# EAGLE design femtoBeacon_BT5_coin (EAGLE 7.6.0)
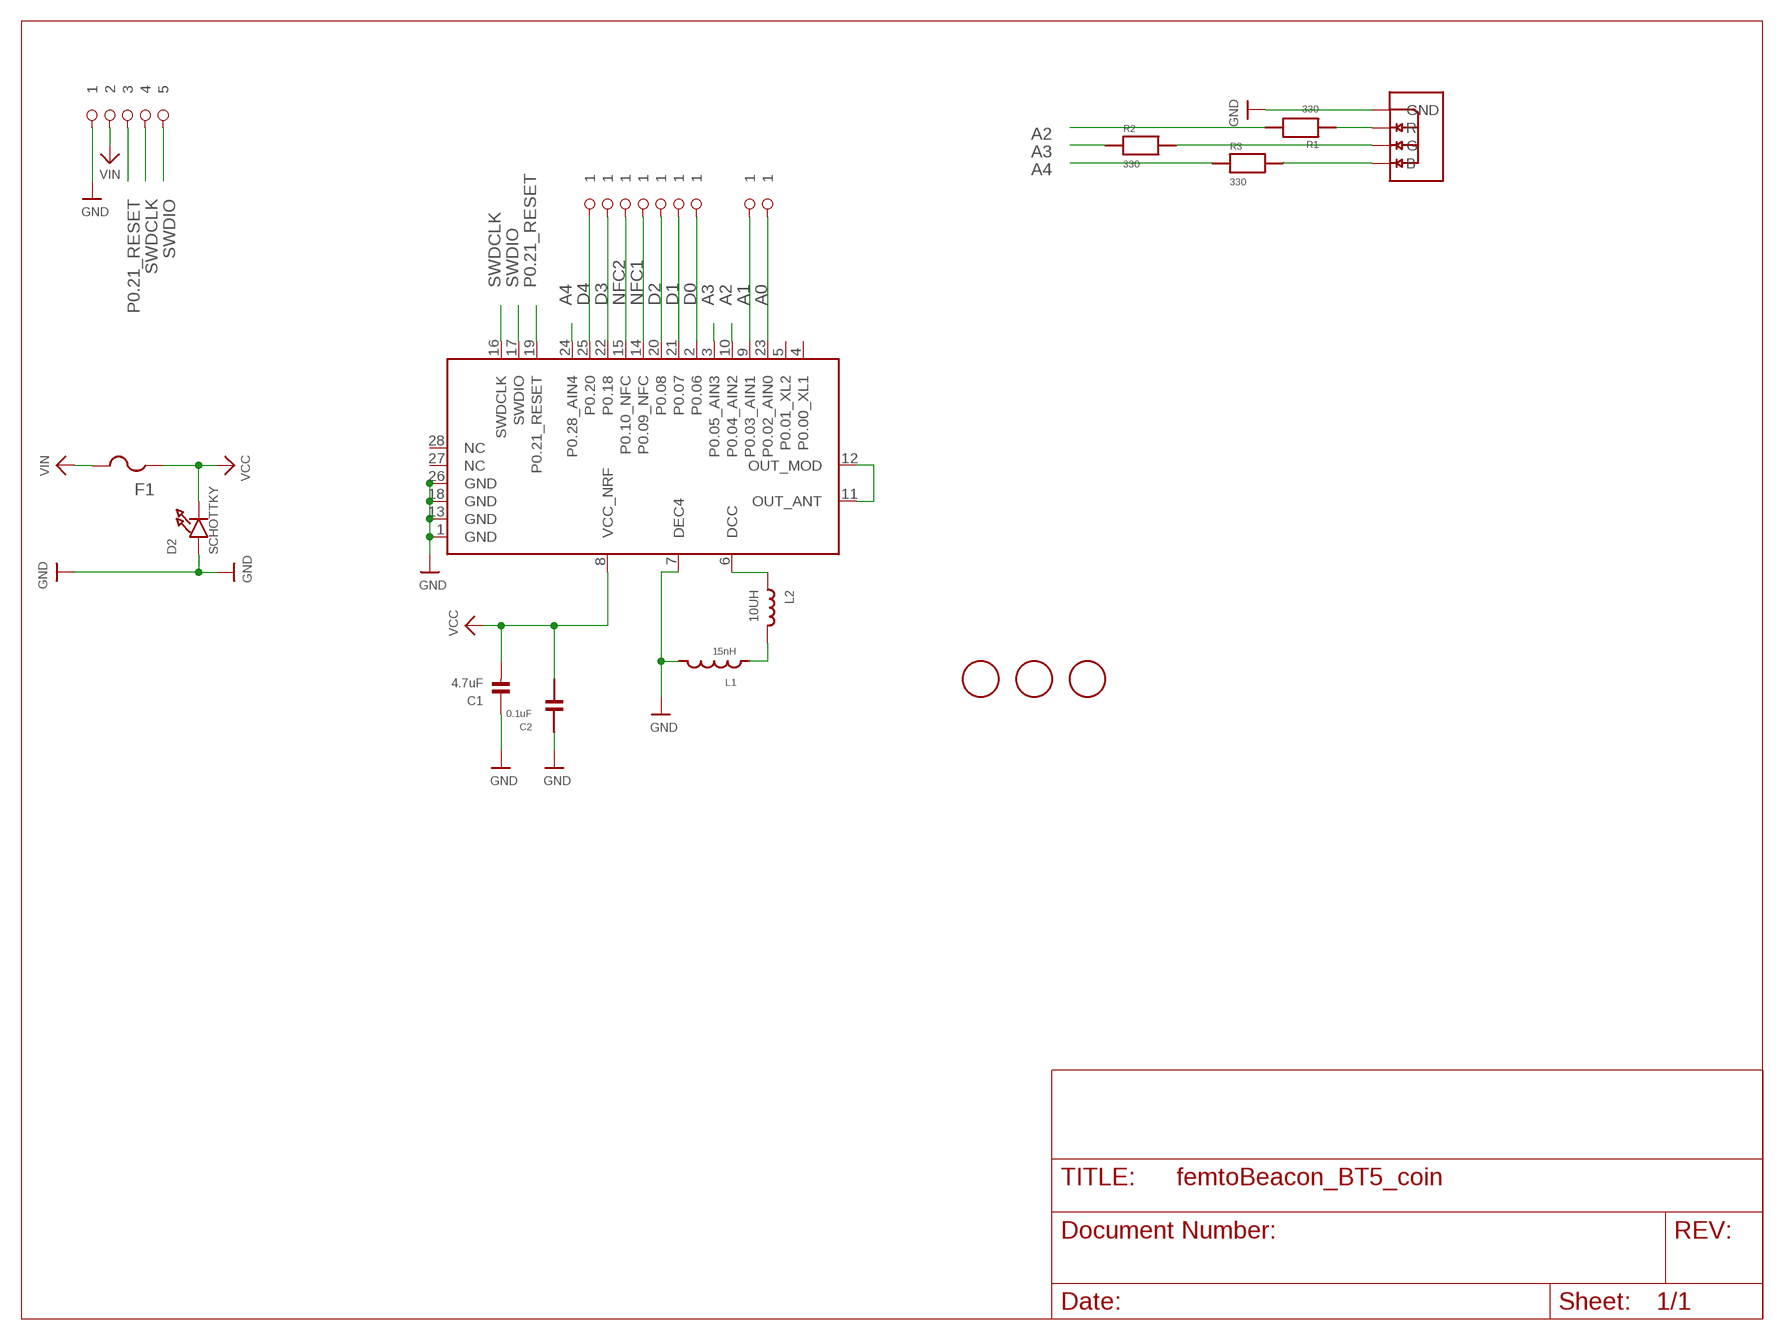
[diagram p0: schematic, sheet 1]

## Parts
C1  4.7uF  CAP_CERAMIC_0402MP  [_0402MP]
C2  0.1uF  CAPACITOR_0201  [PART]
D2  SCHOTTKY  LED0603_NOOUTLINE  [CHIPLED_0603_NOOUTLINE]
F1  PTCFUSE-1206  [R1206]
FID1  FIDUCIAL  [FIDUCIAL_1MM]
FID2  FIDUCIAL  [FIDUCIAL_1MM]
FID3  FIDUCIAL  [FIDUCIAL_1MM]
IC  TY_BLE_EYSHSNZWZ  [MODULE]
L1  15nH  INDUCTOR_FIXED_0201  [PART]
L2  10UH  INDUCTOR_0402MP  [_0402MP]
LED1  LRTB_R48G  [LRTB_R48G]
R1  330  RESISTOR_0201  [PART]
R2  330  RESISTOR_0201  [PART]
R3  330  RESISTOR_0201  [PART]
U$6  1X5_ROUND  [1X5_ROUND]
U$16  1X1_ROUND_MM  [1X1_ROUND_MM]
U$17  1X1_ROUND_MM  [1X1_ROUND_MM]
U$18  1X1_ROUND_MM  [1X1_ROUND_MM]
U$19  1X1_ROUND_MM  [1X1_ROUND_MM]
U$20  1X1_ROUND_MM  [1X1_ROUND_MM]
U$21  1X1_ROUND_MM  [1X1_ROUND_MM]
U$22  1X1_ROUND_MM  [1X1_ROUND_MM]
U$23  1X1_ROUND_MM  [1X1_ROUND_MM]
U$24  1X1_ROUND_MM  [1X1_ROUND_MM]

## Nets
A0: IC.23(P0.02_AIN0) U$16.P$1
A1: IC.9(P0.03_AIN1) U$17.P$1
A2: IC.10(P0.04_AIN2) R1.2
A3: IC.3(P0.05_AIN3) R2.1
A4: IC.24(P0.28_AIN4) R3.1
D0: IC.2(P0.06) U$18.P$1
D1: IC.21(P0.07) U$19.P$1
D2: IC.20(P0.08) U$20.P$1
D3: IC.22(P0.18) U$23.P$1
D4: IC.25(P0.20) U$24.P$1
GND: C1.1 C2.1 D2.A IC.1(GND) IC.7(DEC4) IC.13(GND) IC.18(GND) IC.26(GND) L1.2 LED1.1(GND) U$6.P$1
INTERNAL_ANT: IC.11(OUT_ANT) IC.12(OUT_MOD)
N$1: IC.6(DCC) L2.1
N$2: LED1.2(R) R1.1
N$4: L1.1 L2.2
N$17: LED1.3(G) R2.2
N$18: LED1.4(B) R3.2
NFC1: IC.14(P0.09_NFC) U$21.P$1
NFC2: IC.15(P0.10_NFC) U$22.P$1
P0.21_RESET: IC.19(P0.21_RESET) U$6.P$3
SWDCLK: IC.16(SWDCLK) U$6.P$4
SWDIO: IC.17(SWDIO) U$6.P$5
VCC: C1.2 C2.2 D2.C F1.1 IC.8(VCC_NRF)
VIN: F1.2 U$6.P$2
Unconnected: IC.4(P0.00_XL1) IC.5(P0.01_XL2) IC.27(NC) IC.28(NC)

## Library data of the parts
C1 = microbuilder:CAP_CERAMIC: Ceramic Capacitors 0402 - 0402 Surface Mount Capacitors 16pF 50V 5% [Digikey: 445-4899-2-ND] 18pF 50V 5% [Digikey: 490-1281-2-ND] 22pF 50V 5% [Digikey: 490-1283-2-ND] 68pF 50V 5% [Digikey: 490-1289-2-ND] 0.1uF 10V 10% [Digikey: 490-1318-2-ND] 1.0uF 6.3V 10% [Digikey: 490-1320-2-ND] 0603 - 0603 Surface Mount Capacitors 16 pF 50V 5% [Digikey: 445-5051-2-ND] 22 pF 50V [Digikey: PCC220ACVTR-ND] 33 pF 50V 5% [Digikey: 490-1415-1-ND] 56pF 50V 5% [Digikey: 490-1421-1-ND] 220pF 50V 5% [Digikey: 445-1285-1-ND] 680 pF 50V 2200 pF 50V 5% C0G [Digikey: 445-1297-1-ND] 5600 pF 100V 5% X7R [Digikey: 478-3711-1-ND] 0.1 µF 25V 10% [Digikey: PCC2277TR-ND] 0.22 µF 16V 10% X7R [Digikey: 445-1318-1-ND] 1.0 µF 25V 10% [Digikey: 445-5146-2-ND] 0603 - RF Specific 3pF 250V +/-0.1pF RF [Digikey: 712-1347-1-ND] 18 pF 250V 5% [Digikey: 478-3505-1-ND or 712-1322-1-ND] 56 pF 250V 5% C0G RF [Digikey: 490-4867-1-ND] 68 pF 250V RF [Digikey: 490-4868-1-ND] 0805 - 0805 Surface Mount Capacitors 220 pF 250V 2% RF Ceramic Capacitor [Digikey: 712-1398-1-ND] 1000 pF 50V 2% NP0 Ceramic Capacitor [Digikey: 478-3760-1-ND] 0.1 µF 25V 10% Ceramic Capacitor [Digikey: PCC1828TR-ND] 1.0 µF 16V 10% Ceramic Capacitor[Digikey: 490-1691-2-ND] 10.0 µF 10V 10% Ceramic Capacitor[Digikey: 709-1228-1-ND] 10.0 uF 16V 10% Ceramic Capacitor [Digikey: 478-5165-2-ND] 47 uF 6.3V 20% Ceramic Capacitor [Digikey: 587-1779-1-ND or 399-5506-1-ND] 1206 - 1206 Surface Mount Capacitors 47uF 10V 20% Ceramic Capacitor [Digikey: 490-5528-1-ND or 399-5508-1-ND or 445-6010-1-ND] 100uF 6.3V -20%, +80% Y5V Ceramic Capacitor (Digikey: 490-4512-1-ND, Mouser: 81-GRM31CF50J107ZE1L); MFR_ID: CC0402KRX5R6BB475
C2 = parts_0201:CAPACITOR_0201; MFR_ID: GRM033C80J104KE84D
D2 = microbuilder:LED: LED 0603 - 0603 Surface Mount Package 2mA: Green LED - Low Power (3.9mcd, 2ma, 1.7Vf) - Digikey: 475-2709-2-ND Orange LED - Low Power (9.8mcd, 2ma, 1.8Vf) - Digikey: 475-1194-2-ND Red LED - Low Power (5mcd, 2ma, 1.8Vf) - Digikey: 475-1195-2-ND Yellow LED - Low Power (7mcd, 2ma, 1.8Vf) - Digikey: 475-1196-2-ND 5mA: Blue LED - Low Power (17mcd, 5ma, 2.9Vf) - Digikey: LNJ937W8CRACT-ND 0805 - 0805 Surface Mount Package 2mA: Red LED (8.8mcd, 2mA, 1.8Vf, Clear) - Low Power [Digikey: 475-2510-1-ND] Green LED (5mcd, 2mA, 1.8Vf, Clear) - Low Power [Digikey: 475-2730-1-ND] Yellow LED (11.3mcd, 2mA, 1.8Vf, Clear) - Low Power [Digikey: 475-2555-1-ND] 20mA: Red LED (104mcd, 20mA, Diffused) - LS R976 [Digikey: 475-1278-6-ND] Red LED (12mcd, 20mA, 2.0Vf, Clear) - APT2012EC [Digikey: 754-1128-1-ND] Green LED (15mcd, 20mA, 2.2Vf, Clear) - APT2012GC [Digikey: 754-1131-1-ND] Orange LED (160mcd, 20mA, 2.1Vf, Clear) - APT2012SECK [Digikey: 754-1130-1-ND] 1206 - 1206 Surface Mount Package Green LED (26mcd, 20mA, Diffused) - LG N971 [Digikey: 475-1407-6-ND] Red LED (15mcd, 20mA, Diffused) - LH N974 [Digikey: 475-1416-6-ND]; MFR_ID: SD0603S040S0R2
F1 = adafruit:PTCFUSE: PTC fuses, resettable thermistors; MFR_ID: 1206L050/15YR
FID1-FID3 = adafruit:FIDUCIAL: For use by pick and place machines to calibrate the vision/machine, 1mm By microbuilder.eu
IC = taiyo_yuden_bt5:TY_BLE_EYSHSNZWZ; MFR_ID: EYSHSNZWZ
L1 = parts_0201:INDUCTOR_FIXED_0201; MFR_ID: LQP03HQ15NJ02D
L2 = microbuilder:INDUCTOR: Inductors 0603: 10nH Ceramic Inductor - microwire antenna/RF (Digikey: 712-1434-2-ND) 0805: 560nH Ceramic Inductor - RF (Digikey: 553-1047-1-ND) 270nH Ceramic Inductor - Q = 40@250MHz, +-5%, 1 Ohm DC Resistance (Digikey: 535-10506-2-ND) 1007 (2518 Metric) SMT: 10µH 10% 250mOhm 820mA 1007 Inductor (Digikey: 587-2189-1-ND) 22µH 10% 500mOhm 580mA 1007 Inductor (Digikey: 587-2190-1-ND) 47µH 10% 950mOhm 420mA 1007 Inductor (Digikey: 587-2191-1-ND) 47µH 5% 100mOhm 1A 1008 Inductor (Digikey: 732-1816-1-ND) 5.0x5.0mm (Taiyo Yuden NR5040 Series) 6.8µH 20% 2.3A 64mOhm Inductor (Digikey: 587-2374-2-ND) 5.0x5.0mm (TDK VLC5045 Series) 4.7µH 20% 3.3A 34mOhm Inductor (Digikey: 445-6526-1-ND) 6.8µH 20% 2.7A 46mOhm Inductor (Digikey: 445-6527-1-ND) 6.0x6.0mm (TDK VLC6045 Series) 4.7µH 20% 3.8A 27mOhm Inductor (Digikey: 445-6538-2-ND) 6.8µH 20% 3A 41mOhm Inductor (Digikey: 445-6540-1-ND) 6.2µH 30% 2.2A 45mOhm Inductor (Digikey: SRR5028-6R2YCT-ND) - Not TDK VLC6045 but footprint should match 6.0x6.0mm (TDK SLF6045 Series) 6.8uH 30% 2A 33mOhm Inductor (Digikey: 445-4572-1-ND, Mouser: 810-SLF645T6R8N2R0PF); MFR_ID: LQM18FN100M00D
LED1 = osram_opto_LED:LRTB_R48G
R1-R3 = parts_0201:RESISTOR_0201; MFR_ID: CRCW0201330RJNED
U$6 = pins_1.27mm_pitch:1X5_ROUND
U$16-U$24 = pins_1.27mm_pitch:1X1_ROUND_MM

## Board
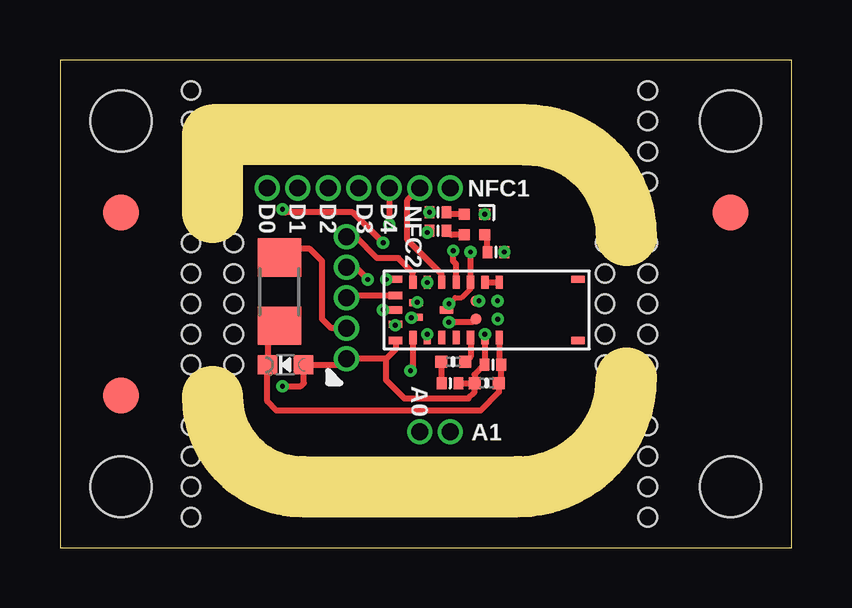
[diagram p1: board, top side]
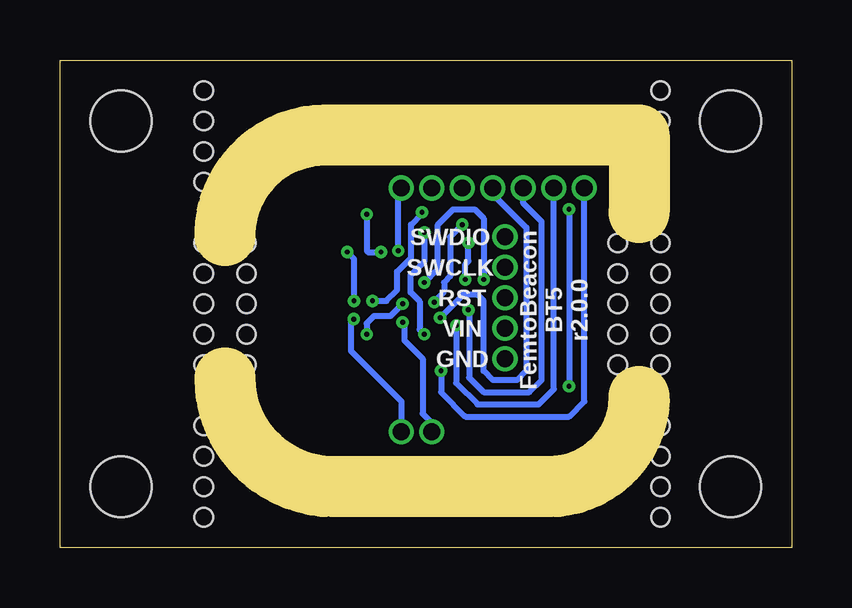
[diagram p2: board, bottom side, seen from below]

Size 30.48 x 20.32 mm. Coordinates in mm from the lower left corner, seen from the top.
Outline: 0,0 30.48,0 30.48,20.32 0,20.32 0,0
Copper layers (1*16): Top 0.035559375mm / dielectric 1.6mm / Bottom 0.035559375mm
Design rules "oshpark-2layer *": minimum track width 6mil, minimum drill 10mil, track to track 6mil, track to pad 6mil, pad to pad 6mil, via to via 6mil, smd to smd 6mil, copper to edge 15mil, drill to drill 6mil, minimum pad ring 5mil, minimum via ring 5mil, stop-mask expansion 2.5mil, vias tented up to drill 10mil, thermal gap 10mil
Holes 0.76 mm at 7.24,12.7 7.24,11.43 7.24,10.16 7.24,8.89 7.24,7.62 22.71,7.62 22.71,8.89 22.71,10.16 22.71,11.43 22.71,12.7 5.46,12.7 5.46,11.43 5.46,10.16 5.46,8.89 5.46,7.62 24.49,12.7 24.49,11.43 24.49,10.16 24.49,8.89 24.49,7.62 5.46,17.78 5.46,19.05 5.46,1.27 5.46,2.54 5.46,3.81 5.46,5.08 24.49,15.24 24.49,16.51 24.49,17.78 24.49,19.05 24.49,5.08 24.49,3.81 24.49,2.54 24.49,1.27
Holes 2.54 mm at 2.54,17.78 27.94,17.78 27.94,2.54 2.54,2.54
tRestrict: area 18.5,4.3 to 21.8,15.5
bRestrict: area 18.5,4.3 to 21.8,15.5
Milling: 6 lines

### Footprints (pad centres in the part's own frame; a part is rotated, then mirrored left to right if it is on the bottom)
_0402MP = smd 0.5 x 0.5: 1 -0.508,0; 2 0.508,0
PART = smd 0.4 x 0.5: 1 -0.35,0; 2 0.35,0
CHIPLED_0603_NOOUTLINE = smd 0.8 x 0.8: A 0,-0.75; C 0,0.75
R1206 = smd 1.6 x 1.803: 1 -1.422,0; 2 1.422,0
FIDUCIAL_1MM = smd 1.5 x 1.5: 1 0,0
MODULE = smd 0.55 x 0.3: 1 -3.8,-1.275; 18 -3.8,1.275; 19 -3.8,0.6; 20 -3.8,0; 21 -3.8,-0.6; 22 -2.95,-0.3; 25 -2.95,0.3; 26 -1.675,0; 27 3.8,-1.275; 28 3.8,1.275 | smd 0.3 x 0.55: 2 -3.075,-1.15; 3 -2.475,-1.15; 4 -1.875,-1.15; 5 -1.275,-1.15; 6 -0.675,-1.15; 7 -0.075,-1.15; 8 0.525,-1.15; 11 0.525,1.15; 12 -0.075,1.15; 13 -0.675,1.15; 14 -1.275,1.15; 15 -1.875,1.15; 16 -2.475,1.15; 17 -3.075,1.15 | smd 0.45 x 0.45: 9 0.45,-0.375; 10 0.45,0.375; 23 -0.45,-0.375; 24 -0.45,0.375
LRTB_R48G = smd 0.45 x 0.45: 1 0.425,0.425; 2 0.425,-0.425; 3 -0.425,-0.425; 4 -0.425,0.425
1X5_ROUND = drill 0.7 pad 1: P$1 0,0; P$2 0,-1.27; P$3 0,-2.54; P$4 0,-3.81; P$5 0,-5.08
1X1_ROUND_MM = drill 0.7 pad 1: P$1 0,0

### Placement (x,y rotation side)
C1  17.78,6.86 0 top
C2  18.03,7.62 0 top
D2  9.4,7.62 90 top
F1  9.14,10.67 90 top
FID1  2.54,6.35 0 top
FID2  2.54,13.97 0 top
FID3  27.94,13.97 0 top
IC  17.78,9.91 0 top
L1  16.26,6.86 0 top
L2  16.38,7.75 180 top
LED1  17.27,13.46 0 top
R1  18.16,12.32 0 top
R2  15.75,13.21 0 top
R3  15.75,13.97 0 top
U$6  11.94,7.87 180 top
U$16  14.99,4.83 0 top
U$17  16.26,4.83 0 top
U$18  8.64,14.99 0 top
U$19  9.91,14.99 0 top
U$20  11.18,14.99 0 top
U$21  16.26,14.99 0 top
U$22  14.99,14.99 0 top
U$23  12.45,14.99 0 top
U$24  13.72,14.99 0 top

### Tracks (layer width: path | path; a pad name or v marks a point on that pad's centre or on a via)
A0  (via drill 0.2 pad 0.51)
  Top 0.254: IC.23 17.2,9.4 v16.2,9.4
  Bottom 0.254: v16.2,9.4 16.13,9.32 16.13,8.64 15.37,7.87 15.37,5.59 14.99,5.21 U$16.P$1
A1  (via drill 0.2 pad 0.51)
  Top 0.254: IC.9 v18.24,9.53
  Bottom 0.254: v18.24,9.53 18.36,9.4 18.36,8.2 16.26,6.1 U$17.P$1
A2  (via drill 0.2 pad 0.51)
  Bottom 0.254: IC.10 18.23,12.04 R1.2
  other vias: 18.23,10.28 18.51,12.32
A3  (via drill 0.2 pad 0.51)
  Top 0.254: IC.3 v15.3,8.89 | R2.1 v15.3,13.13
  Bottom 0.254: v15.3,8.89 15.49,9.08 15.49,10.26 15.88,10.64 15.88,11.35 15.29,11.94 15.29,13.04 v15.3,13.13
A4  (via drill 0.2 pad 0.51)
  Top 0.203: IC.24 v17.46,10.28
  Bottom 0.254: v17.46,10.28 16.89,10.28 16.43,10.73 16.43,11.51 15.85,12.09 15.85,13.46 15.4,13.91 R3.1
  other vias: 15.4,13.97
D0  (via drill 0.2 pad 0.51)
  Top 0.254: IC.2 14.71,7.47 v14.61,7.37
  Bottom 0.254: v14.61,7.37 14.61,6.48 13.59,5.46 9.27,5.46 8.64,6.1 U$18.P$1
D1  (via drill 0.2 pad 0.51)
  Top 0.254: IC.21 14.01,9.31 v13.97,9.27
  Bottom 0.254: v13.97,9.27 13.97,6.86 13.08,5.97 10.54,5.97 9.91,6.6 U$19.P$1
D2  (via drill 0.2 pad 0.51)
  Top 0.254: IC.20 v13.46,9.91
  Bottom 0.254: U$20.P$1 11.18,14.35 10.41,13.59 10.41,6.99 10.92,6.48 12.83,6.48 13.44,7.09 13.44,9.88 v13.46,9.91
D3  (via drill 0.2 pad 0.51)
  Top 0.254: IC.22 v14.64,9.58
  Bottom 0.254: U$23.P$1 12.45,14.73 11.05,13.34 11.05,7.37 11.43,6.99 12.45,6.99 12.83,7.37 12.83,10.29 13.08,10.54 13.68,10.54 v14.64,9.58
D4  (via drill 0.2 pad 0.51)
  Top 0.254: IC.25 v14.88,10.23 | U$24.P$1 v13.72,13.46
  Bottom 0.254: v13.72,13.46 14.22,12.95 14.22,11.3 14.48,11.05 14.48,10.67 14.91,10.23 v14.88,10.23
GND  (via drill 0.2 pad 0.51)
  Top 0.203: v16.21,10.16 16.46,10.41 16.74,10.41 17.11,10.78 IC.13
  Top 0.254: C1.1 17.27,7.21 C2.1 17.7,7.64 IC.7 v17.7,8.89 | IC.13 v17.11,12.32 | L1.2 C1.1 | 13.59,7.87 13.98,8.27 IC.1 | 13.59,7.87 U$6.P$1 11.68,7.62 D2.A 10.16,7.61 10.16,6.86 10.03,6.73 v9.27,6.73 | IC.18 13.98,11.17 v13.59,11.18 | v13.46,12.7 12.19,13.97 9.4,13.97 v9.27,14.1 | 13.59,7.87 13.59,6.99 14.35,6.22 17.02,6.22 17.27,6.48 C1.1 | IC.26 16.21,10.01 v16.21,10.16
  Bottom 0.254: LED1.1 17.7,12.36 17.65,12.32 v17.11,12.32 | v9.27,14.1 v9.27,6.73 | v17.7,8.89 17.7,9.35 17.4,9.65 16.71,9.65 16.26,10.11 v16.21,10.16 | v13.59,11.18 13.59,11.81 13.46,11.94 v13.46,12.7
  other vias: 17.7,13.89
  cutout Bottom (isolate 0.254): 8.13,15.49 18.29,15.49 18.29,4.32 10.22,4.32 arc-90 8.13,6.41
INTERNAL_ANT
  Top 0.254: IC.12 IC.11
N$1
  Top 0.254: IC.6 17.11,7.96 L2.1
N$2
  Top 0.254: R1.1 17.81,12.92 LED1.2
N$4
  Top 0.254: L1.1 15.91,7.72 L2.2
N$17
  Top 0.254: LED1.3 16.31,13.04 R2.2
N$18
  Top 0.254: LED1.4 16.18,13.89 R3.2
NFC1  (via drill 0.2 pad 0.51)
  Top 0.254: IC.14 16.5,11.82 16.38,11.94 v16.38,12.37
  Bottom 0.254: v16.38,12.37 16.38,14.86 U$21.P$1
NFC2
  Top 0.254: IC.15 15.9,11.4 14.48,12.83 14.48,14.48 U$22.P$1
P0.21_RESET
  Top 0.254: IC.19 12.03,10.51 U$6.P$3
SWDCLK  (via drill 0.2 pad 0.51)
  Top 0.254: v15.3,11.06 v15.3,11.05 | v12.83,11.18 12.32,11.68 U$6.P$4
  Bottom 0.254: v15.3,11.05 14.73,11.62 14.73,13.46 14.1,14.1 13.21,14.1 12.83,13.72 v12.83,11.18
SWDIO
  Top 0.254: IC.17 14.71,11.46 14.1,12.06 13.21,12.06 12.32,12.95 U$6.P$5
VCC
  Top 0.254: IC.8 18.3,7.7 C2.2 18.38,6.95 C1.2 18.29,6.48 17.53,5.71 9.02,5.71 8.64,6.1 8.64,7.61 D2.C 8.65,9.26 F1.1
VIN
  Top 0.254: U$6.P$2 11.3,9.14 10.92,9.53 10.92,11.94 10.41,12.45 9.3,12.45 F1.2

### Text on the board
tNames: NFC1 | D0 | D1 | D2 | D3 | D4 | NFC2 | A0 | A1
bNames: SWDIO | SWCLK | FemtoBeacon / BT5 / r2.0.0 | RST | VIN | GND